# EAGLE design esp12power_supply (EAGLE 7.7.0)
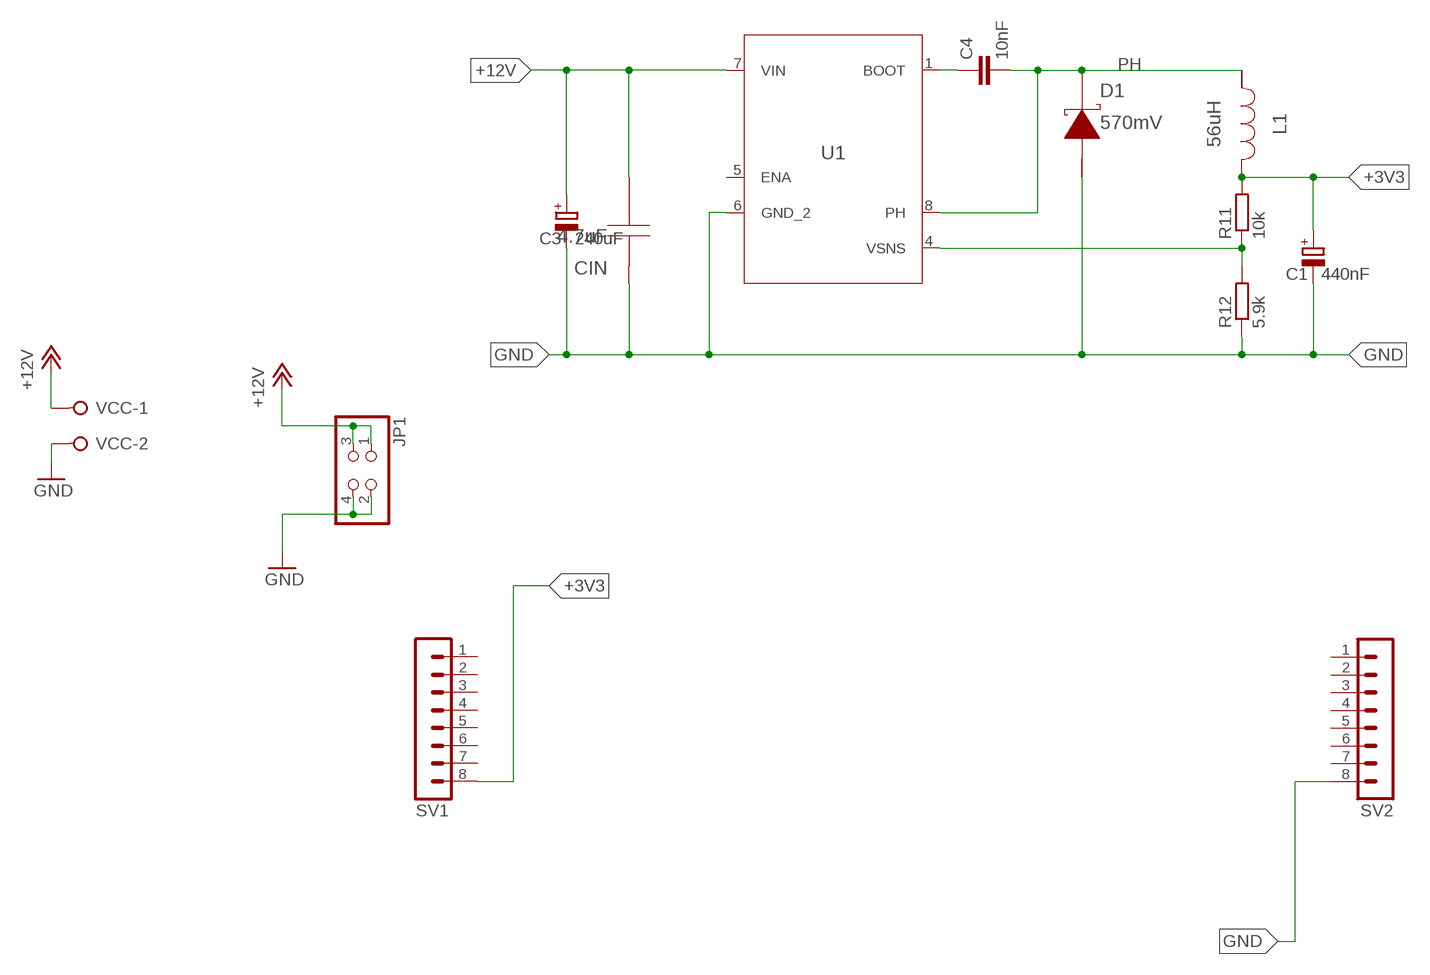
[diagram p0: schematic, sheet 1]

## Parts
C1  440nF  CPOL-EUE2.5-7  [E2,5-7]
C3  240uF  CPOL-EUE2.5-7  [E2,5-7]
C4  10nF  C-EUC0805  [C0805]
CIN  4.7uF  GRM31CR71H475KA12L  [1206]
D1  570mV  B160-13-F  [SMA]
JP1  PINHD-2X2  [2X02]
L1  56uH  NPI75C560KTRF  [IND_NPI75C]
R11  10k  R-EU_R0805  [R0805]
R12  5.9k  R-EU_R0805  [R0805]
SV1  MA08-1  [MA08-1]
SV2  MA08-1  [MA08-1]
U1  TPS5410DR  [M08A]
VCC  W237-02P  [W237-132]

## Nets
+3V3: C1.+ L1.1 R11.2 SV1.8
+12V: C3.+ CIN.2 JP1.1 JP1.3 U1.7(VIN) VCC.1
BOOT: C4.1 U1.1(BOOT)
GND: C1.- C3.- CIN.1 D1.2(A) JP1.2 JP1.4 R12.1 SV2.8 U1.6(GND_2) VCC.2
PH: C4.2 D1.1(K) L1.2 U1.8(PH)
SENS: R11.1 R12.2 U1.4(VSNS)
Unconnected: SV1.1 SV1.2 SV1.3 SV1.4 SV1.5 SV1.6 SV1.7 SV2.1 SV2.2 SV2.3 SV2.4 SV2.5 SV2.6 SV2.7 U1.5(ENA)

## Library data of the parts
C1 C3 = resistor:CPOL-EU: POLARIZED CAPACITOR, European symbol
C4 = resistor:C-EU: CAPACITOR, European symbol
CIN = AcceleratedDesigns_Lib:GRM31CR71H475KA12L; CAP: 4.7E6; ESR: 0.0; IRMS: 0.0; MANUFACTURER_NAME: MuRata; MANUFACTURER_PART_NUMBER: GRM31CR71H475KA12L; VDC: 50.0; VENDOR: MuRata
D1 = TI_Accelerated_Design_neu:B160-13-F; DATASHEETURL: httpwww.diodes.comdatasheetsds13002.pdf; IO: 1.0; MANUFACTURER_NAME: Diodes Inc.; MANUFACTURER_PART_NUMBER: B16013F; VENDOR: Diodes Inc.; VFATIO: 0.7; VRRM: 60.0
JP1 = pinhead:PINHD-2X2: PIN HEADER
L1 = AcceleratedDesigns_Lib:NPI75C560KTRF; DCR: 0.24; IDC: 0.94; L: 5.6E5; MANUFACTURER_NAME: NIC Components; MANUFACTURER_PART_NUMBER: NPI75C560KTRF; VENDOR: NIC Components
R11 R12 = resistor:R-EU_: RESISTOR, European symbol
SV1 SV2 = con-lstb:MA08-1: PIN HEADER; OC_FARNELL: unknown; OC_NEWARK: unknown
U1 = AcceleratedDesigns_Lib:TPS5410DR; DATASHEETURL: httpwww.ti.comproducttps5410; FREQUENCY: 500000.0; IMAX: 1.0; MANUFACTURER_NAME: Texas Instruments; MANUFACTURER_PART_NUMBER: TPS5410DR; MKTG_PACKAGE: TPS5410; NSID: TPS5410D; PACKAGE: TPS5410; VENDOR: Texas Instruments
VCC = con-wago-508:W237-02P: WAGO SREW CLAMP; OC_FARNELL: unknown; OC_NEWARK: unknown

## Net classes
5 Signal: width 0.381 mm

## Board
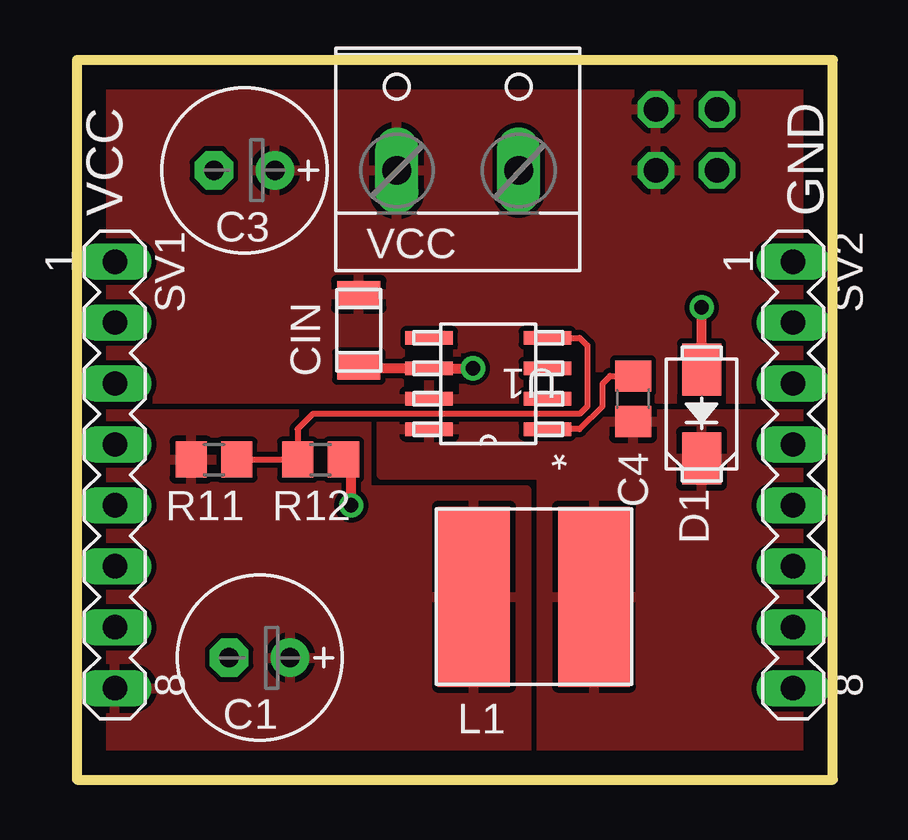
[diagram p1: board, top side]
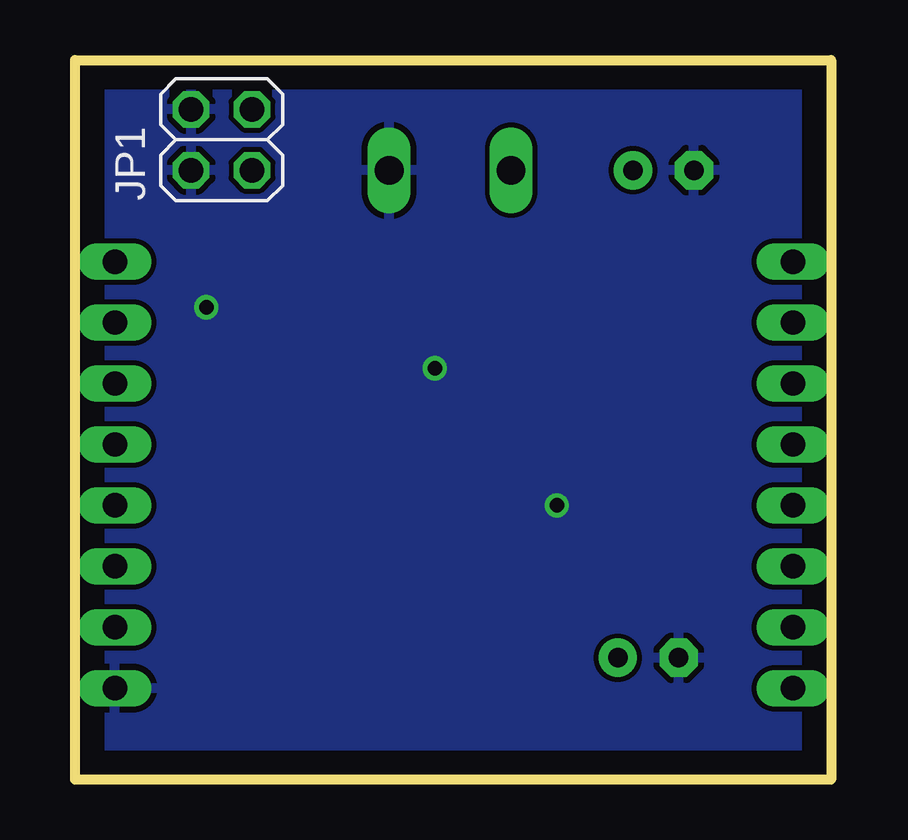
[diagram p2: board, bottom side, seen from below]

Size 31.5 x 30 mm. Coordinates in mm from the lower left corner, seen from the top.
Outline: 0,0 31.5,0 31.5,30 0,30 0,0
Copper layers (1*16): Top 0.035mm / dielectric 1.5mm / Bottom 0.035mm
Design rules "default": minimum track width 10mil, minimum drill 24mil, track to track 8mil, track to pad 8mil, pad to pad 8mil, via to via 8mil, smd to smd 8mil, copper to edge 40mil, drill to drill 8mil, minimum pad ring 10mil, minimum via ring 8mil, stop-mask expansion 4mil, vias tented up to drill 0mil, thermal gap 10mil

### Footprints (pad centres in the part's own frame; a part is rotated, then mirrored left to right if it is on the bottom)
E2,5-7 = drill 0.813 pad 1.6: + -1.27,0 | drill 0.813 pad 1.6 octagon: - 1.27,0
C0805 = smd 1.3 x 1.5: 1 -0.95,0; 2 0.95,0
1206 = smd 1.118 x 1.803: 1 -1.499,0; 2 1.499,0
SMA = smd 2.184 x 1.626: 1 -1.854,0; 2 1.854,0
2X02 = drill 1.016 octagon: 1 -1.27,-1.27; 2 -1.27,1.27; 3 1.27,-1.27; 4 1.27,1.27
IND_NPI75C = smd 2.997 x 7.493: 1 -2.502,0; 2 2.502,0
R0805 = smd 1.3 x 1.5: 1 -0.95,0; 2 0.95,0
MA08-1 = drill 1.016 long: 1 -8.89,0; 2 -6.35,0; 3 -3.81,0; 4 -1.27,0; 5 1.27,0; 6 3.81,0; 7 6.35,0; 8 8.89,0
M08A = smd 1.981 x 0.559: 1 -2.464,1.905; 2 -2.464,0.635; 3 -2.464,-0.635; 4 -2.464,-1.905; 5 2.464,-1.905; 6 2.464,-0.635; 7 2.464,0.635; 8 2.464,1.905
W237-132 = drill 1.194 long: 1 -2.54,-0.635; 2 2.54,-0.635

### Placement (x,y rotation side)
C1  7.62,5.08 180 top
C3  6.99,25.4 180 top
C4  23.18,15.88 270 top
CIN  11.75,18.73 90 top
D1  26.04,15.24 90 top
JP1  25.4,26.67 90 bottom
L1  19.05,7.62 0 top
R11  5.71,13.34 180 top
R12  10.16,13.34 180 top
SV1  1.59,12.7 270 top
SV2  29.84,12.7 270 top
U1  17.14,16.51 180 top
VCC  15.88,26.04 0 top

### Tracks (layer width: path | path; a pad name or v marks a point on that pad's centre or on a via)
+3V3
  pour Top: 0,15.24 12.06,15.24 12.06,12.06 18.73,12.06 18.73,0 0,0
+12V
  pour Top: 0,29.84 31.11,29.84 31.11,15.88 0,15.88
BOOT
  Top 0.254: U1.1 20.95,14.61 21.91,15.56 21.91,16.51 22.23,16.83 C4.1
GND  (via drill 0.6)
  Top 0.406: v11.43,11.43 11.43,13.02 R12.1 | CIN.1 11.84,17.14 U1.6 v16.51,17.14 | D1.2 v26.04,19.68
  pour Bottom: 0,29.84 31.11,29.84 31.11,0 0,0
PH
  pour Top: 12.7,15.24 31.11,15.24 31.11,0 19.37,0 19.37,12.7 12.7,12.7
SENS
  Top 0.254: U1.4 20.95,18.41 21.27,18.1 21.27,15.56 20.95,15.24 9.84,15.24 9.21,14.61 R12.2 R11.1

### Text on the board
tNames: VCC | GND